# Altium schematic sheet [2]-BLOCK_DIAGRAM.SchDoc
size A4
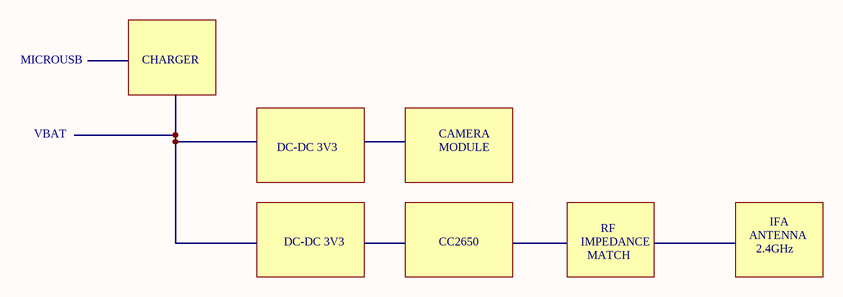
[diagram p0: [2]-BLOCK_DIAGRAM.SchDoc]

## Notes on the sheet
- MICROUSB
- CHARGER
- VBAT
- DC-DC 3V3
- CAMERA
- MODULE
- CC2650
- IMPEDANCE
- RF
- ANTENNA
- 2.4GHz
- IFA
- MATCH